# Altium schematic sheet Power&FT232.SchDoc
size A4
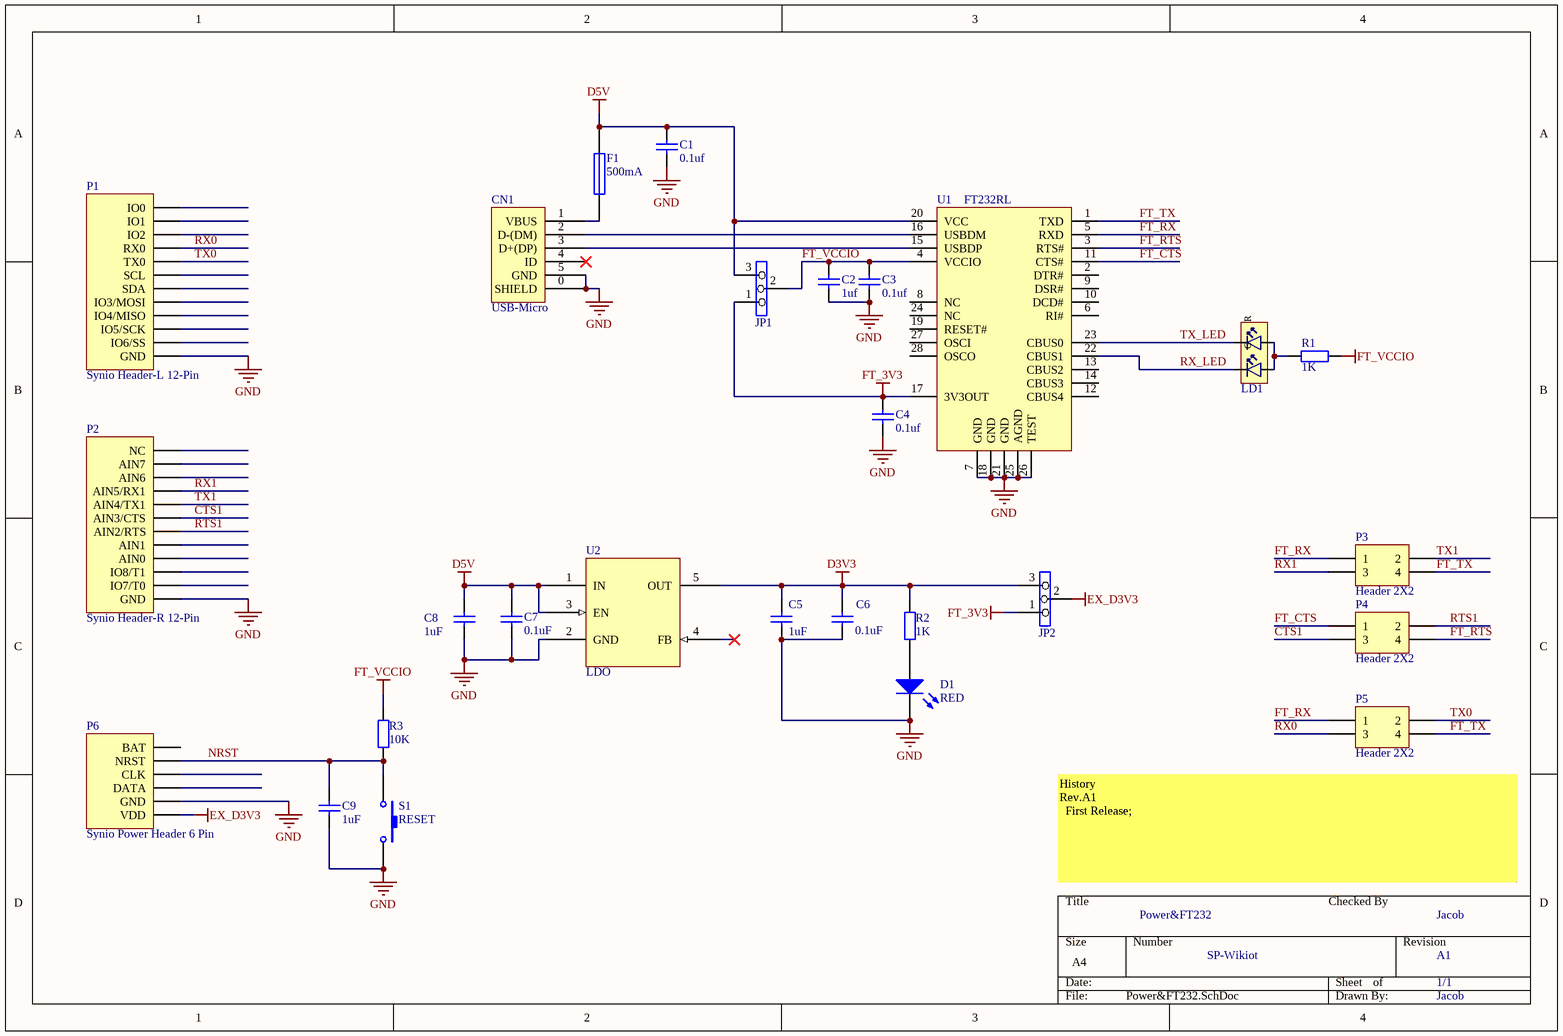
[diagram p0: Power&FT232.SchDoc]

## Parts
C1  value 0.1uf  [C0603L]  (hidden comment: Cap)
C2  value 1uf  [C0603L]  (hidden comment: Cap)
C3  value 0.1uf  [C0603L]  (hidden comment: Cap)
C4  value 0.1uf  [C0603L]  (hidden comment: Cap)
C5  1uF  [C0603L]
C6  0.1uF  [C0603L]
C7  0.1uF  [C0603L]
C8  1uF  [C0603L]
C9  1uF  [C0603L]
CN1  USB-Micro  [USB-MICRO-Female-Lite]
D1  RED  [0603pn]
F1  500mA  [0805]
JP1  Jumper3  [HDR1X3/2.54MM]  (value not drawn)
JP2  Jumper3  [HDR1X3/2.54MM]  (value not drawn)
LD1  LTST-C195KGJRKT  [0805-LED-Bi]  (value not drawn)
P1  Synio Header-L 12-Pin  [HDR1X12-L/2.54MM]
P2  Synio Header-R 12-Pin  [HDR1X12-L/2.54MM]
P3  Header 2X2  [HDR2X2/2.54MM]
P4  Header 2X2  [HDR2X2/2.54MM]
P5  Header 2X2  [HDR2X2/2.54MM]
P6  Synio Power Header 6 Pin  [HDR1X6-L/2.54MM]
R1  1K  [0603M]
R2  1K  [0603M]
R3  10K  [0603M]
S1  RESET  [KEY-2x4-SMD]
U1  FT232RL  [SSOP-28_M]
U2  LDO  [SOT23-5]

## Nets
D3V3: C5.2 C6.2 JP2.3 R2.2 U2.5(OUT)
D5V: C1.2 C7.2 C8.2 F1.1 JP1.3 U1.20(VCC) U2.1(IN) U2.3(EN)
EX_D3V3: JP2.2 P6.1(VDD)
FT_3V3: C4.2 JP1.1 JP2.1 U1.17(3V3OUT)
FT_VCCIO: C2.2 C3.2 JP1.2 R1.1 R3.1 U1.4(VCCIO)
GND: C1.1 C2.1 C3.1 C4.1 C5.1 C6.1 C7.1 C8.1 C9.1 CN1.0(SHIELD) CN1.5(GND) D1.2(K) P1.1(GND) P2.1(GND) P6.2(GND) S1.1 U1.7(GND) U1.18(GND) U1.21(GND) U1.25(AGND) U1.26(TEST) U2.2(GND)
CTS1: P2.7(AIN3/CTS) P4.3
FT_CTS: P4.1 U1.11(CTS#)
FT_RTS: P4.4 U1.3(RTS#)
FT_RX: P3.1 P5.1 U1.5(RXD)
FT_TX: P3.4 P5.4 U1.1(TXD)
NRST: C9.2 P6.5(NRST) R3.2 S1.2
RTS1: P2.6(AIN2/RTS) P4.2
RX0: P1.9(RX0) P5.3
RX1: P2.9(AIN5/RX1) P3.3
RX_LED: LD1.1(C1) U1.22(CBUS1)
TX0: P1.8(TX0) P5.2
TX1: P2.8(AIN4/TX1) P3.2
TX_LED: LD1.2(C2) U1.23(CBUS0)
NetCN1_1: CN1.1(VBUS) F1.2
NetCN1_2: CN1.2(D-(DM)) U1.16(USBDM)
NetCN1_3: CN1.3(D+(DP)) U1.15(USBDP)
NetD1_1: D1.1(A) R2.1
NetLD1_3: LD1.3(A2) LD1.4(A1) R1.2

Not connected (* = marked no-connect by the designer): CN1 4(ID)*; P1 2(IO6/SS) 3(IO5/SCK) 4(IO4/MISO) 5(IO3/MOSI) 6(SDA) 7(SCL) 10(IO2) 11(IO1) 12(IO0); P2 2(IO7/T0) 3(IO8/T1) 4(AIN0) 5(AIN1) 10(AIN6) 11(AIN7) 12(NC); P6 3(DATA) 4(CLK) 6(BAT); U1 2(DTR#) 6(RI#) 8(NC) 9(DSR#) 10(DCD#) 12(CBUS4) 13(CBUS2) 14(CBUS3) 19(RESET#) 24(NC) 27(OSCI) 28(OSCO); U2 4(FB)*

## Notes on the sheet
- (near P5) History
  Rev.A1
  First Release;
- Power&FT232
- Checked By
- Jacob
- SP-Wikiot
- A1
- 1/1
- (in symbol LED-DUAL) R; G

## Library data of the parts
C1-C9 = Cap: Capacitor; Published: 8-Jun-2000; LatestRevisionDate: 17-Jul-2002; LatestRevisionNote: Re-released for DXP Platform.
  C1-C4: Publisher: Altium Limited
  C5 C8: PackageReference: RAD-0.3; Value: 1uF
  C6 C7: PackageReference: RAD-0.3; Value: 0.1uF
  C9: PackageReference: RAD-0.3; Publisher: Altium Limited; Value: 1uF
D1 = LED0: Typical INFRARED GaAs LED; Published: 8-Jun-2000; LatestRevisionDate: 08-Jul-2005; LatestRevisionNote: Mech Layer 1 removed.; PackageReference: LED-0; Publisher: Altium Limited
F1 = Fuse 1: Fuse; Published: 8-Jun-2000; LatestRevisionDate: 17-Jul-2002; LatestRevisionNote: Re-released for DXP Platform.; PackageReference: PIN-W2/E2.8; Publisher: Altium Limited; PackageDescription: Thru-Hole; 2 Leads
LD1 = LED-DUAL: Avago, HSMF-A203 Bi-Color LED; Manufacturer: Lite-On Inc; 2nd source part number: 859-LTST-C195KGJRKT; Note: HSMF-A203- xxxxx GaP Red GaP Emerald Green; Artikkelnr Noca: 13019145; Part Number: LTST-C195KGJRKT; Manufacturer Part Number: LTST-C195KGJRKT; Datasheet: http://media.digikey.com/pdf/Data%20Sheets/Lite-On%20PDFs/LTST-C195KGJRKT.pdf; Footprint: LED_DUAL_0606; LatestRevisionDate: 2012-07-05; Pin Count: 4; Publisher: Nordic Semiconductor; Published: 2012-07-05; Value: LTST-C195KGJRKT; Supplier: Digi-Key; Supplier part number: 160-1452-1-ND; 2nd source Supplier: Mouser
P1 = Synio Header-L 12-Pin: Synio Header-L, 12-Pin; LatestRevisionDate: 17-Jul-2002; LatestRevisionNote: Re-released for DXP Platform.; Publisher: Altium Limited
P2 = Synio Header-R 12-Pin: Synio Header-R, 12-Pin; LatestRevisionDate: 17-Jul-2002; LatestRevisionNote: Re-released for DXP Platform.; Publisher: Altium Limited
P3-P5 = Header 2X2: Header, 2-Pin, Dual row; LatestRevisionDate: 17-Jul-2002; LatestRevisionNote: Re-released for DXP Platform.; Publisher: Altium Limited
R1-R3 = Res2: Resistor; Published: 8-Jun-2000; LatestRevisionDate: 17-Jul-2002; LatestRevisionNote: Re-released for DXP Platform.; PackageReference: AXIAL-0.4; Publisher: Altium Limited
  R1 R2: Value: 1K
  R3: Value: 10K
S1 = SW-PB: Switch; Published: 24-Mar-1999; LatestRevisionDate: 17-Jul-2002; LatestRevisionNote: Re-released for DXP Platform.; PackageReference: SPST-2; Publisher: Altium Limited
U1 = FT232RL: USB UART IC
U2 = LDO-SOT23-5: General LDO SOT23-5